# EAGLE design OPENAG-V1-RJ45_with_PCA9615DPJ_dI2C_Buffer (EAGLE 8.5.0)
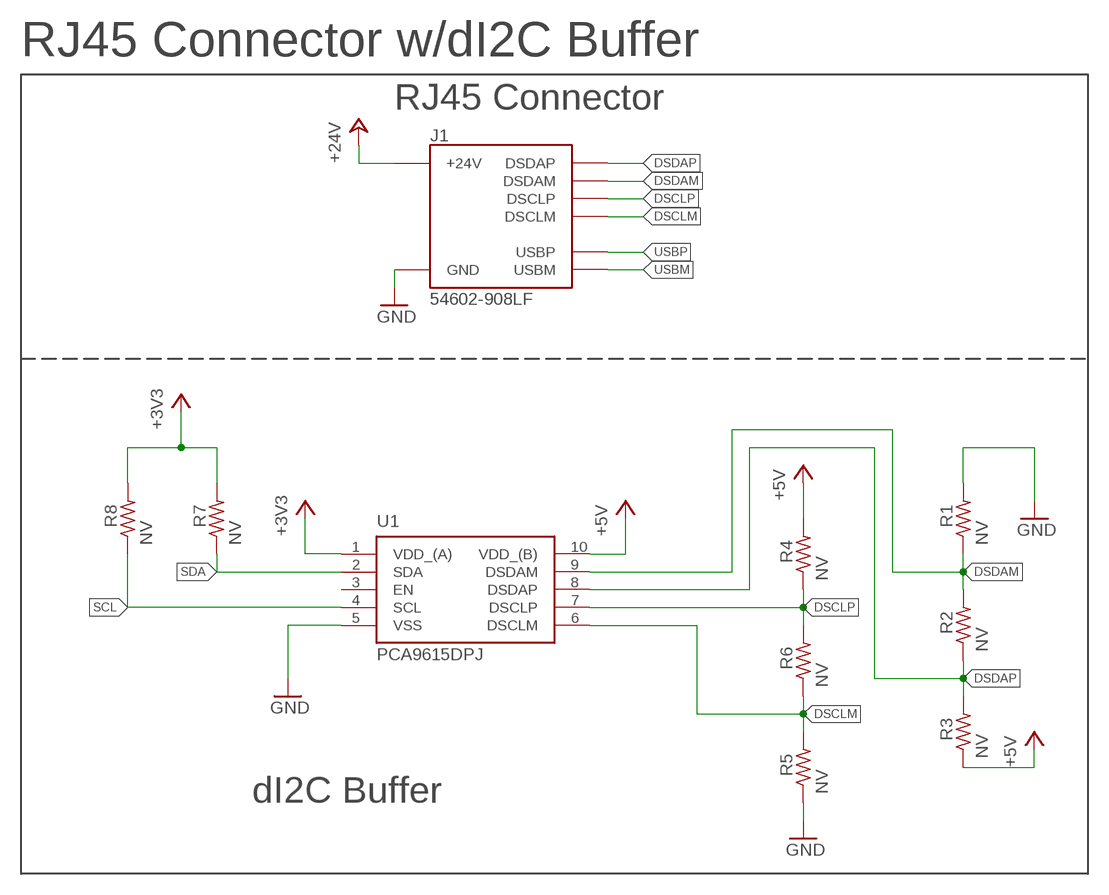
[diagram p0: schematic, sheet 1]

## Parts
J1  54602-908LF  OPENAG-V1-RJ45PTH  [OPENAG-V1-RJ45]
R1  NV  R0603  [RC0603N]
R2  NV  R0603  [RC0603N]
R3  NV  R0603  [RC0603N]
R4  NV  R0603  [RC0603N]
R5  NV  R0603  [RC0603N]
R6  NV  R0603  [RC0603N]
R7  NV  R0603  [RC0603N]
R8  NV  R0603  [RC0603N]
U1  PCA9615DPJ  [SOP50P490X110-10N]

## Nets
+3V3: R7.2 R8.2 U1.1(VDD_(A))
+5V: R3.1 R4.2 U1.10(VDD_(B))
+24V: J1.24V(6)(+24V)
DSCLM: J1.DSCLM(5)(DSCLM) R5.2 R6.1 U1.6(DSCLM)
DSCLP: J1.DSCLP(4)(DSCLP) R4.1 R6.2 U1.7(DSCLP)
DSDAM: J1.DSDAM(2)(DSDAM) R1.1 R2.2 U1.9(DSDAM)
DSDAP: J1.DSDAP(1)(DSDAP) R2.1 R3.2 U1.8(DSDAP)
GND: J1.GND(3)(GND) R1.2 R5.1 U1.5(VSS)
SCL: R8.1 U1.4(SCL)
SDA: R7.1 U1.2(SDA)
USBM: J1.USBM(8)(USBM)
USBP: J1.USBP(7)(USBP)
Unconnected: U1.3(EN)

## Notes on the sheet
- RJ45 Connector w/dI2C Buffer
- RJ45 Connector
- dI2C Buffer

## Library data of the parts
J1 = openag_connector:OPENAG-V1-RJ45: Amphenol FCI - 54602-908LF - CONN MOD JACK 8P8C R/A UNSHLD Description: Jack Modular Connector 8p8c (RJ45, Ethernet) 90� Angle (Right) Unshielded Cat3 Technical Specifications: Connector Type: Jack Number of Positions/Contacts: 8p8c (RJ45, Ethernet) Number of Ports: 1 Number of Rows: 1 Mounting Type: Through Hole Orientation: 90� Angle (Right) Termination: Solder Shielding: Unshielded Ratings: Cat3 Features: Board Lock LED Color: Does Not Contain LED Tab Direction: Down Contact Material: Copper Alloy Contact Finish: Gold Contact Finish Thickness: 15�in (0.38�m) Housing Material: Polyester, Glass Filled Operating Temperature: -40�C ~ 70�C Datasheet(s): 54601-x04(zzz)WPLF Drawing <http://cdn.amphenol-icc.com/media/wysiwyg/files/drawing/c-bmj-0102.pdf> Vendor(s): Digikey: 609-1046-ND <https://www.digikey.com/product-detail/en/amphenol-fci/54602-908LF/609-1046-ND/1001360>; POPULATE: YES; VERIFIED: NO
R1-R8 = openag-resistors:R0603: Placeholder 0603 Resistor
U1 = openag-buffers:PCA9615DPJ: NXP USA Inc. - PCA9615DPJ - IC REDRIVER I2C 2CH 10TSSOP Description: Buffer, ReDriver 2 Channel 400kHz 10-TSSOP Technical Specifications: Type: Buffer, ReDriver Applications: I²C Input: 2-Wire Bus Output: 2-Wire Bus Data Rate (Max): 400kHz Number of Channels: 2 Capacitance - Input: 7pF Voltage - Supply: 2.3 V ~ 5.5 V Current - Supply: 16µA Operating Temperature: -40°C ~ 85°C Package / Case: 10-TFSOP, 10-MSOP (0.118", 3.00mm Width) Supplier Device Package: 10-TSSOP Base Part Number: PCA9615 Datasheet(s): PCA9615DP <http://www.nxp.com/documents/data_sheet/PCA9615.pdf> Vendor(s): Digikey: 568-11484-1-ND <https://www.digikey.com/product-detail/en/nxp-usa-inc/PCA9615DPJ/568-11484-1-ND/4864508>

## Board
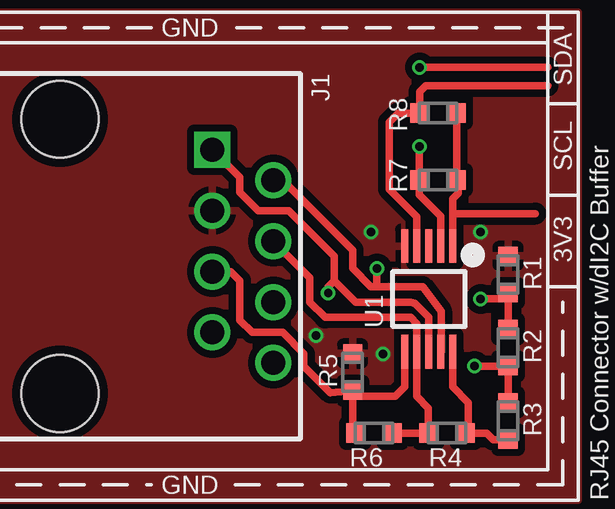
[diagram p1: board, top side]
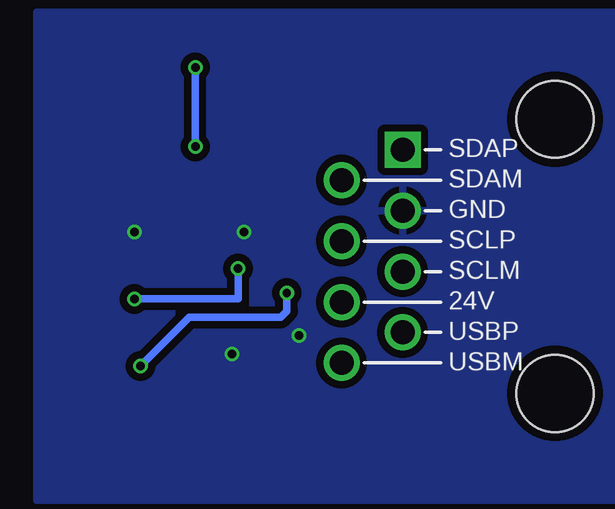
[diagram p2: board, bottom side, seen from below]

No outline drawn. Coordinates in mm, seen from the top.
Copper layers (1*16): Top 0.035559375mm / dielectric 1.6mm / Bottom 0.035559375mm
Design rules "oshpark-2layer-mask": minimum track width 6mil, minimum drill 10mil, track to track 6mil, track to pad 6mil, pad to pad 6mil, via to via 6mil, smd to smd 6mil, copper to edge 15mil, drill to drill 6mil, minimum pad ring 5mil, minimum via ring 5mil, stop-mask expansion 2.5mil, vias tented up to drill 20mil, thermal gap 10mil

### Footprints (pad centres in the part's own frame; a part is rotated, then mirrored left to right if it is on the bottom)
OPENAG-V1-RJ45 = drill 1: 24V(6) 1.905,8.89; DSCLM(5) 0.635,6.35; DSCLP(4) -0.635,8.89; DSDAM(2) -3.175,8.89; GND(3) -1.905,6.35; USBM(8) 4.445,8.89; USBP(7) 3.175,6.35 | drill 1 square: DSDAP(1) -4.445,6.35 | hole 3.2: -5.715,0; 5.715,0
RC0603N = smd 0.756 x 0.8: 1 -0.778,0; 2 0.778,0
SOP50P490X110-10N = smd 1.4 x 0.3: 1 -2.2,1; 2 -2.2,0.5; 3 -2.2,0; 4 -2.2,-0.5; 5 -2.2,-1; 6 2.2,-1; 7 2.2,-0.5; 8 2.2,0; 9 2.2,0.5; 10 2.2,1

### Placement (x,y rotation side)
J1  12.7,10.16 270 top
R1  31.37,9.4 90 top
R2  31.37,6.35 90 top
R3  31.37,3.3 90 top
R4  28.83,2.79 0 top
R5  24.89,5.33 270 top
R6  25.78,2.79 0 top
R7  28.45,13.34 0 top
R8  28.45,16.13 0 top
U1  28.07,8.38 270 top

### Tracks (layer width: path | path; a pad name or v marks a point on that pad's centre or on a via)
+3V3
  Top 0.305: U1.1 29.07,11.94 | 29.07,11.94 29.07,12.56 29.3,12.79 29.3,13.26 R7.2 R8.2 | 29.07,11.94 32.51,11.94
+5V
  Top 0.305: U1.10 29.07,4.71 29.72,4.06 29.72,2.83 R4.2 30.48,2.79 30.75,2.52 R3.1
DSCLM
  Top 0.305: R6.1 24.89,2.83 24.89,4.32 | 24.89,4.32 R5.2 23.96,4.48 22.86,5.59 22.86,6.1 21.97,6.99 20.7,6.99 20.19,7.49 20.19,9.14 19.81,9.53 J1.DSCLM(5) | U1.6 27.07,4.71 26.67,4.32 24.89,4.32
DSCLP
  Top 0.305: R6.2 R4.1 28.05,3.83 27.57,4.32 U1.7 27.57,7.36 27.3,7.62 23.75,7.62 23.11,8.26 23.11,9.27 J1.DSCLP(4)
DSDAM  (via drill 0.35)
  Top 0.305: J1.DSDAM(2) 21.97,13.34 24.89,10.41 24.89,9.65 25.65,8.89 25.91,8.89 | 25.91,8.89 27.81,8.89 28.57,7.87 U1.9 | R2.2 R1.1 arc-90 31.2,8.38 v30.23,8.38 30.1,8.38 | v25.91,9.65 25.91,8.89
  Bottom 0.305: v30.23,8.38 25.91,8.38 v25.91,9.65
DSDAP  (via drill 0.35)
  Top 0.305: R3.2 R2.1 29.99,5.57 v29.97,5.59 | 24.13,9.14 25.02,8.26 27.3,8.26 27.48,8.2 28.07,7.62 U1.8 | J1.DSDAP(1) 20.19,13.46 20.19,12.83 20.95,12.06 22.23,12.06 24.13,10.16 24.13,9.14 | v23.88,8.64 23.88,8.89 24.13,9.14
  Bottom 0.305: v29.97,5.59 27.94,7.62 24.13,7.62 23.88,7.87 v23.88,8.64
GND  (via drill 0.35)
  other vias: 25.65,11.18 30.23,11.18 26.16,6.1 23.37,6.86
  pour Top (isolate 0.305): 0,0 34.29,0 34.29,20.32 0,20.32
  pour Bottom (isolate 0.305): 34.29,0 34.29,20.32 0,20.32 0,0
SCL
  Top 0.305: U1.4 27.57,11.8 26.42,12.95 26.42,15.75 26.8,16.13 R8.1 27.69,16.14 27.69,17.02 27.94,17.27 33.02,17.27
SDA  (via drill 0.35)
  Top 0.305: U1.2 28.57,11.82 27.67,12.72 R7.1 27.67,14.72 v27.69,14.73 | v27.69,18.03 33.02,18.03
  Bottom 0.305: v27.69,14.73 v27.69,18.03

### Text on the board
tPlace: GND | SDA | SCL | 3V3 | EDGE | GND | RJ45 Connector w/dI2C Buffer